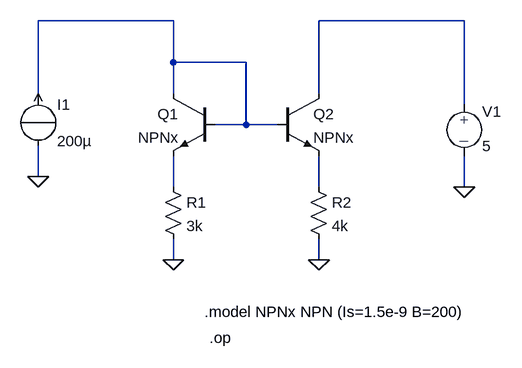
[diagram p0: schematic Stromspiegel_unsymm.asc]
Stromspiegel_unsymm.asc, the LTspice schematic file:
Version 4
SHEET 1 880 680
WIRE -176 32 -384 32
WIRE 272 32 48 32
WIRE -176 96 -176 32
WIRE -64 96 -176 96
WIRE -384 144 -384 32
WIRE -176 144 -176 96
WIRE 48 144 48 32
WIRE 272 160 272 32
WIRE -64 192 -64 96
WIRE -64 192 -112 192
WIRE -16 192 -64 192
WIRE -384 272 -384 224
WIRE -176 288 -176 240
WIRE 48 288 48 240
WIRE 272 288 272 240
WIRE -176 400 -176 368
WIRE 48 400 48 368
FLAG 48 400 0
FLAG -384 272 0
FLAG 272 288 0
FLAG -176 400 0
SYMBOL source-V 272 144 R0
WINDOW 123 0 0 Left 0
WINDOW 39 0 0 Left 0
SYMATTR InstName V1
SYMATTR Value 5
SYMBOL source-I -384 144 R0
WINDOW 123 0 0 Left 0
WINDOW 39 0 0 Left 0
SYMATTR InstName I1
SYMATTR Value 200µ
SYMBOL EIT_Semiconductors\\npn -16 144 R0
SYMATTR InstName Q2
SYMATTR Value NPNx
SYMBOL EIT_Semiconductors\\npn -112 144 M0
SYMATTR InstName Q1
SYMATTR Value NPNx
SYMBOL res 32 272 R0
SYMATTR InstName R2
SYMATTR Value 4k
SYMBOL res -192 272 R0
SYMATTR InstName R1
SYMATTR Value 3k
TEXT -128 480 Left 0 !.model NPNx NPN (Is=1.5e-9 B=200)
TEXT -120 520 Left 0 !.op

The netlist it stands for:
* Stromspiegel_unsymm.asc
V1 N002 0 5
I1 0 N001 200µ
Q2 N002 N001 N004 0 NPNx
Q1 N001 N001 N003 0 NPNx
R2 N004 0 4k
R1 N003 0 3k
.model NPN NPN
.model PNP PNP
.lib standard.bjt
.model NPNx NPN (Is=1.5e-9 B=200)
.op
.backanno
.end